# Altium schematic sheet backplane.SchDoc
size A2
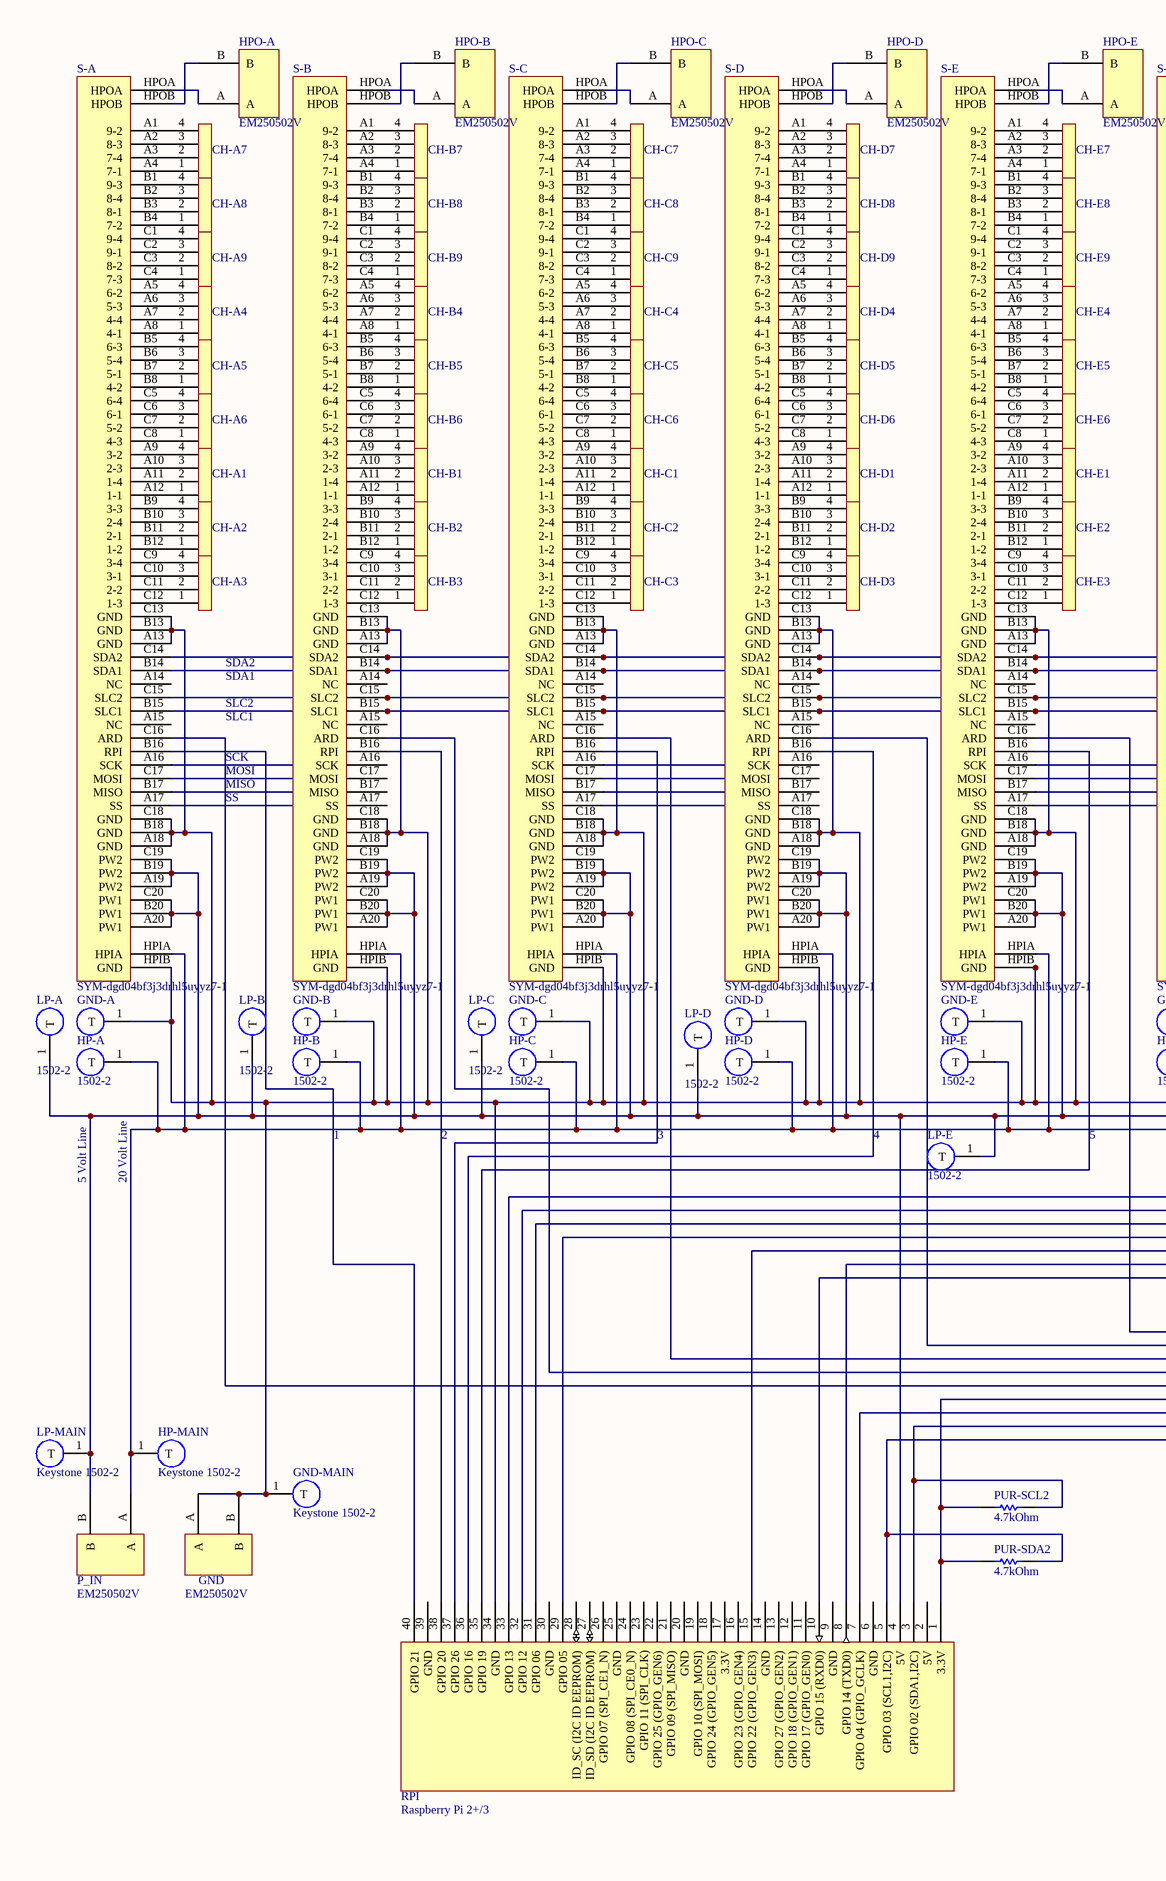
[diagram p0: backplane.SchDoc, left]
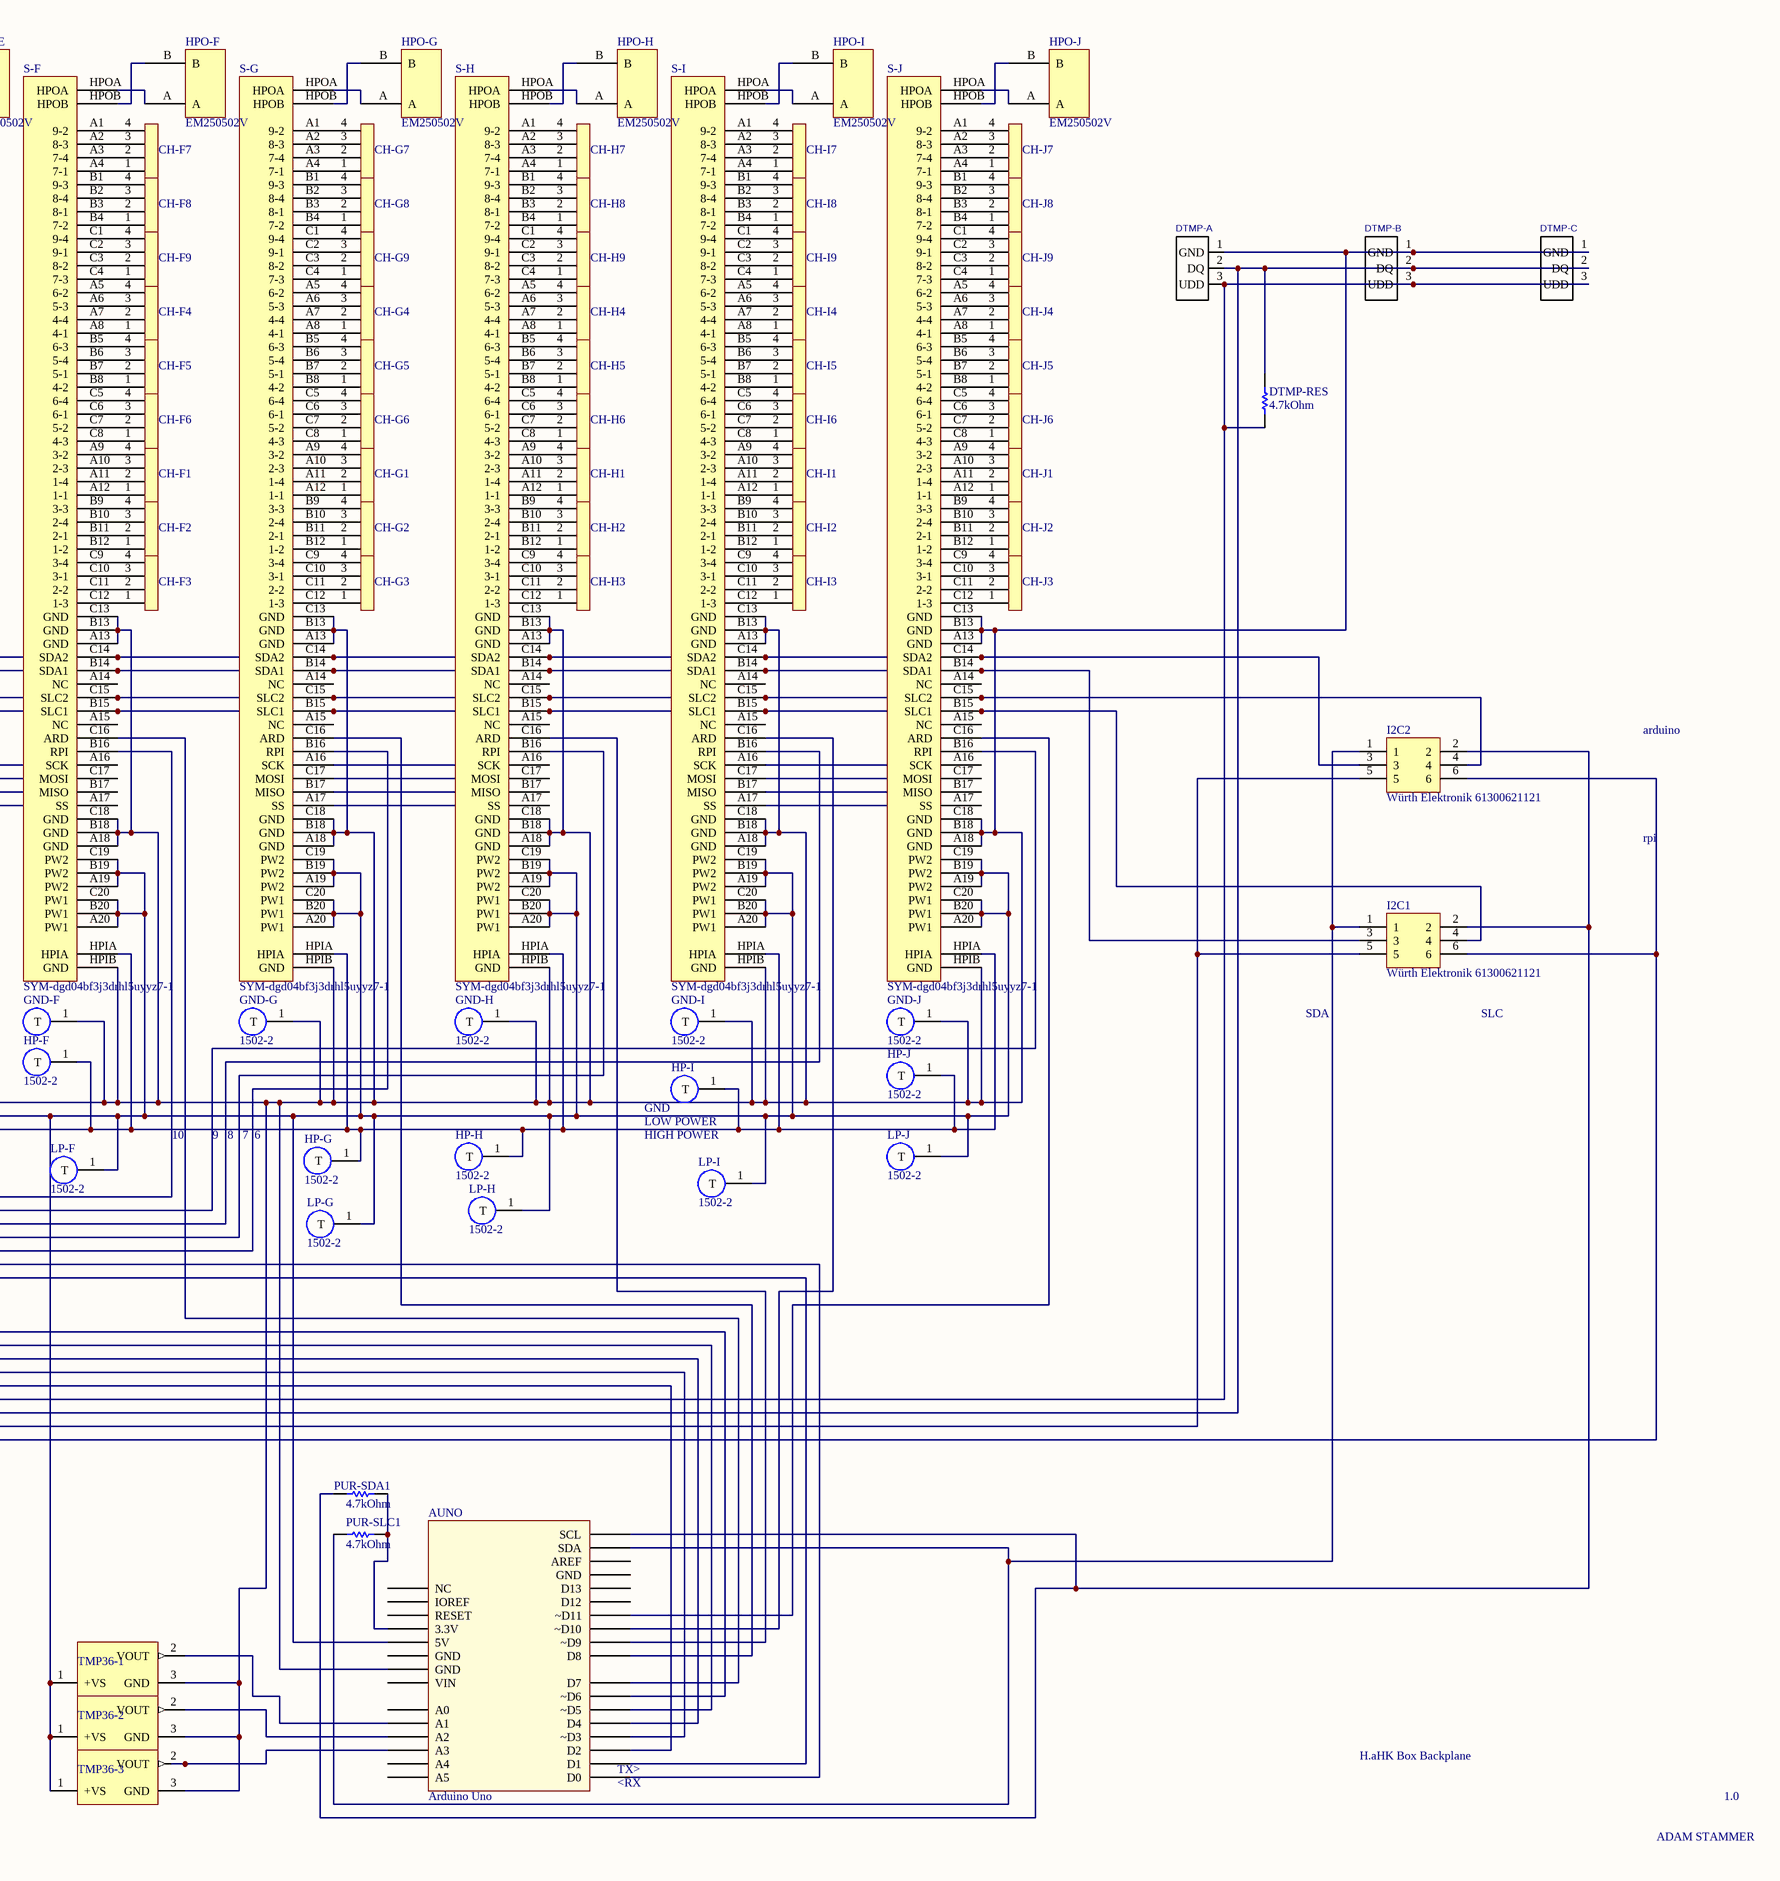
[diagram p1: backplane.SchDoc, right]

## Parts
AUNO  Arduino Uno  [PCB-5e3n8s0ey5jqr2f9nncc-1]
CH-A1  Molex 22-28-4043  [HEADER_1x4]  (value not drawn)
CH-A2  Molex 22-28-4043  [HEADER_1x4]  (value not drawn)
CH-A3  Molex 22-28-4043  [HEADER_1x4]  (value not drawn)
CH-A4  Molex 22-28-4043  [HEADER_1x4]  (value not drawn)
CH-A5  Molex 22-28-4043  [HEADER_1x4]  (value not drawn)
CH-A6  Molex 22-28-4043  [HEADER_1x4]  (value not drawn)
CH-A7  Molex 22-28-4043  [HEADER_1x4]  (value not drawn)
CH-A8  Molex 22-28-4043  [HEADER_1x4]  (value not drawn)
CH-A9  Molex 22-28-4043  [HEADER_1x4]  (value not drawn)
CH-B1  Molex 22-28-4043  [HEADER_1x4]  (value not drawn)
CH-B2  Molex 22-28-4043  [HEADER_1x4]  (value not drawn)
CH-B3  Molex 22-28-4043  [HEADER_1x4]  (value not drawn)
CH-B4  Molex 22-28-4043  [HEADER_1x4]  (value not drawn)
CH-B5  Molex 22-28-4043  [HEADER_1x4]  (value not drawn)
CH-B6  Molex 22-28-4043  [HEADER_1x4]  (value not drawn)
CH-B7  Molex 22-28-4043  [HEADER_1x4]  (value not drawn)
CH-B8  Molex 22-28-4043  [HEADER_1x4]  (value not drawn)
CH-B9  Molex 22-28-4043  [HEADER_1x4]  (value not drawn)
CH-C1  Molex 22-28-4043  [HEADER_1x4]  (value not drawn)
CH-C2  Molex 22-28-4043  [HEADER_1x4]  (value not drawn)
CH-C3  Molex 22-28-4043  [HEADER_1x4]  (value not drawn)
CH-C4  Molex 22-28-4043  [HEADER_1x4]  (value not drawn)
CH-C5  Molex 22-28-4043  [HEADER_1x4]  (value not drawn)
CH-C6  Molex 22-28-4043  [HEADER_1x4]  (value not drawn)
CH-C7  Molex 22-28-4043  [HEADER_1x4]  (value not drawn)
CH-C8  Molex 22-28-4043  [HEADER_1x4]  (value not drawn)
CH-C9  Molex 22-28-4043  [HEADER_1x4]  (value not drawn)
CH-D1  Molex 22-28-4043  [HEADER_1x4]  (value not drawn)
CH-D2  Molex 22-28-4043  [HEADER_1x4]  (value not drawn)
CH-D3  Molex 22-28-4043  [HEADER_1x4]  (value not drawn)
CH-D4  Molex 22-28-4043  [HEADER_1x4]  (value not drawn)
CH-D5  Molex 22-28-4043  [HEADER_1x4]  (value not drawn)
CH-D6  Molex 22-28-4043  [HEADER_1x4]  (value not drawn)
CH-D7  Molex 22-28-4043  [HEADER_1x4]  (value not drawn)
CH-D8  Molex 22-28-4043  [HEADER_1x4]  (value not drawn)
CH-D9  Molex 22-28-4043  [HEADER_1x4]  (value not drawn)
CH-E1  Molex 22-28-4043  [HEADER_1x4]  (value not drawn)
CH-E2  Molex 22-28-4043  [HEADER_1x4]  (value not drawn)
CH-E3  Molex 22-28-4043  [HEADER_1x4]  (value not drawn)
CH-E4  Molex 22-28-4043  [HEADER_1x4]  (value not drawn)
CH-E5  Molex 22-28-4043  [HEADER_1x4]  (value not drawn)
CH-E6  Molex 22-28-4043  [HEADER_1x4]  (value not drawn)
CH-E7  Molex 22-28-4043  [HEADER_1x4]  (value not drawn)
CH-E8  Molex 22-28-4043  [HEADER_1x4]  (value not drawn)
CH-E9  Molex 22-28-4043  [HEADER_1x4]  (value not drawn)
CH-F1  Molex 22-28-4043  [HEADER_1x4]  (value not drawn)
CH-F2  Molex 22-28-4043  [HEADER_1x4]  (value not drawn)
CH-F3  Molex 22-28-4043  [HEADER_1x4]  (value not drawn)
CH-F4  Molex 22-28-4043  [HEADER_1x4]  (value not drawn)
CH-F5  Molex 22-28-4043  [HEADER_1x4]  (value not drawn)
CH-F6  Molex 22-28-4043  [HEADER_1x4]  (value not drawn)
CH-F7  Molex 22-28-4043  [HEADER_1x4]  (value not drawn)
CH-F8  Molex 22-28-4043  [HEADER_1x4]  (value not drawn)
CH-F9  Molex 22-28-4043  [HEADER_1x4]  (value not drawn)
CH-G1  Molex 22-28-4043  [HEADER_1x4]  (value not drawn)
CH-G2  Molex 22-28-4043  [HEADER_1x4]  (value not drawn)
CH-G3  Molex 22-28-4043  [HEADER_1x4]  (value not drawn)
CH-G4  Molex 22-28-4043  [HEADER_1x4]  (value not drawn)
CH-G5  Molex 22-28-4043  [HEADER_1x4]  (value not drawn)
CH-G6  Molex 22-28-4043  [HEADER_1x4]  (value not drawn)
CH-G7  Molex 22-28-4043  [HEADER_1x4]  (value not drawn)
CH-G8  Molex 22-28-4043  [HEADER_1x4]  (value not drawn)
CH-G9  Molex 22-28-4043  [HEADER_1x4]  (value not drawn)
CH-H1  Molex 22-28-4043  [HEADER_1x4]  (value not drawn)
CH-H2  Molex 22-28-4043  [HEADER_1x4]  (value not drawn)
CH-H3  Molex 22-28-4043  [HEADER_1x4]  (value not drawn)
CH-H4  Molex 22-28-4043  [HEADER_1x4]  (value not drawn)
CH-H5  Molex 22-28-4043  [HEADER_1x4]  (value not drawn)
CH-H6  Molex 22-28-4043  [HEADER_1x4]  (value not drawn)
CH-H7  Molex 22-28-4043  [HEADER_1x4]  (value not drawn)
CH-H8  Molex 22-28-4043  [HEADER_1x4]  (value not drawn)
CH-H9  Molex 22-28-4043  [HEADER_1x4]  (value not drawn)
CH-I1  Molex 22-28-4043  [HEADER_1x4]  (value not drawn)
CH-I2  Molex 22-28-4043  [HEADER_1x4]  (value not drawn)
CH-I3  Molex 22-28-4043  [HEADER_1x4]  (value not drawn)
CH-I4  Molex 22-28-4043  [HEADER_1x4]  (value not drawn)
CH-I5  Molex 22-28-4043  [HEADER_1x4]  (value not drawn)
CH-I6  Molex 22-28-4043  [HEADER_1x4]  (value not drawn)
CH-I7  Molex 22-28-4043  [HEADER_1x4]  (value not drawn)
CH-I8  Molex 22-28-4043  [HEADER_1x4]  (value not drawn)
CH-I9  Molex 22-28-4043  [HEADER_1x4]  (value not drawn)
CH-J1  Molex 22-28-4043  [HEADER_1x4]  (value not drawn)
CH-J2  Molex 22-28-4043  [HEADER_1x4]  (value not drawn)
CH-J3  Molex 22-28-4043  [HEADER_1x4]  (value not drawn)
CH-J4  Molex 22-28-4043  [HEADER_1x4]  (value not drawn)
CH-J5  Molex 22-28-4043  [HEADER_1x4]  (value not drawn)
CH-J6  Molex 22-28-4043  [HEADER_1x4]  (value not drawn)
CH-J7  Molex 22-28-4043  [HEADER_1x4]  (value not drawn)
CH-J8  Molex 22-28-4043  [HEADER_1x4]  (value not drawn)
CH-J9  Molex 22-28-4043  [HEADER_1x4]  (value not drawn)
DTMP-A  Maxim Integrated DS18B20+  [PCB-6xl7qimvuxkxf3clfff9-1]  (value not drawn)
DTMP-B  Maxim Integrated DS18B20+  [PCB-6xl7qimvuxkxf3clfff9-1]  (value not drawn)
DTMP-C  Maxim Integrated DS18B20+  [PCB-6xl7qimvuxkxf3clfff9-1]  (value not drawn)
DTMP-RES  4.7kOhm  [PCB-3trqkg5dul8e4bq69e8d-1]
GND  EM250502V  [PCB-u2v43o1ftwqs3duy389i-1]
GND-A  1502-2  [PCB-3pxxqie2fct8emy2m3uy-1]  (value not drawn)
GND-B  1502-2  [PCB-3pxxqie2fct8emy2m3uy-1]  (value not drawn)
GND-C  1502-2  [PCB-3pxxqie2fct8emy2m3uy-1]  (value not drawn)
GND-D  1502-2  [PCB-3pxxqie2fct8emy2m3uy-1]  (value not drawn)
GND-E  1502-2  [PCB-3pxxqie2fct8emy2m3uy-1]  (value not drawn)
GND-F  1502-2  [PCB-3pxxqie2fct8emy2m3uy-1]  (value not drawn)
GND-G  1502-2  [PCB-3pxxqie2fct8emy2m3uy-1]
GND-H  1502-2  [PCB-3pxxqie2fct8emy2m3uy-1]
GND-I  1502-2  [PCB-3pxxqie2fct8emy2m3uy-1]
GND-J  1502-2  [PCB-3pxxqie2fct8emy2m3uy-1]
GND-MAIN  Keystone 1502-2  [PCB-3pxxqie2fct8emy2m3uy-1]
HP-A  1502-2  [PCB-3pxxqie2fct8emy2m3uy-1]
HP-B  1502-2  [PCB-3pxxqie2fct8emy2m3uy-1]
HP-C  1502-2  [PCB-3pxxqie2fct8emy2m3uy-1]
HP-D  1502-2  [PCB-3pxxqie2fct8emy2m3uy-1]
HP-E  1502-2  [PCB-3pxxqie2fct8emy2m3uy-1]
HP-F  1502-2  [PCB-3pxxqie2fct8emy2m3uy-1]
HP-G  1502-2  [PCB-3pxxqie2fct8emy2m3uy-1]
HP-H  1502-2  [PCB-3pxxqie2fct8emy2m3uy-1]
HP-I  1502-2  [PCB-3pxxqie2fct8emy2m3uy-1]  (value not drawn)
HP-J  1502-2  [PCB-3pxxqie2fct8emy2m3uy-1]
HP-MAIN  Keystone 1502-2  [PCB-3pxxqie2fct8emy2m3uy-1]
HPO-A  EM250502V  [PCB-u2v43o1ftwqs3duy389i-1]
HPO-B  EM250502V  [PCB-u2v43o1ftwqs3duy389i-1]
HPO-C  EM250502V  [PCB-u2v43o1ftwqs3duy389i-1]
HPO-D  EM250502V  [PCB-u2v43o1ftwqs3duy389i-1]
HPO-E  EM250502V  [PCB-u2v43o1ftwqs3duy389i-1]
HPO-F  EM250502V  [PCB-u2v43o1ftwqs3duy389i-1]
HPO-G  EM250502V  [PCB-u2v43o1ftwqs3duy389i-1]
HPO-H  EM250502V  [PCB-u2v43o1ftwqs3duy389i-1]
HPO-I  EM250502V  [PCB-u2v43o1ftwqs3duy389i-1]
HPO-J  EM250502V  [PCB-u2v43o1ftwqs3duy389i-1]
I2C1  Würth Elektronik 61300621121  [PCB-zvoyfznuc9b5lzhitk0z-1]
I2C2  Würth Elektronik 61300621121  [PCB-zvoyfznuc9b5lzhitk0z-1]
LP-A  1502-2  [PCB-3pxxqie2fct8emy2m3uy-1]
LP-B  1502-2  [PCB-3pxxqie2fct8emy2m3uy-1]
LP-C  1502-2  [PCB-3pxxqie2fct8emy2m3uy-1]
LP-D  1502-2  [PCB-3pxxqie2fct8emy2m3uy-1]
LP-E  1502-2  [PCB-3pxxqie2fct8emy2m3uy-1]
LP-F  1502-2  [PCB-3pxxqie2fct8emy2m3uy-1]
LP-G  1502-2  [PCB-3pxxqie2fct8emy2m3uy-1]
LP-H  1502-2  [PCB-3pxxqie2fct8emy2m3uy-1]
LP-I  1502-2  [PCB-3pxxqie2fct8emy2m3uy-1]
LP-J  1502-2  [PCB-3pxxqie2fct8emy2m3uy-1]
LP-MAIN  Keystone 1502-2  [PCB-3pxxqie2fct8emy2m3uy-1]
P_IN  EM250502V  [PCB-u2v43o1ftwqs3duy389i-1]
PUR-SCL2  4.7kOhm  [PCB-3trqkg5dul8e4bq69e8d-1]
PUR-SDA1  4.7kOhm  [PCB-3trqkg5dul8e4bq69e8d-1]
PUR-SDA2  4.7kOhm  [PCB-3trqkg5dul8e4bq69e8d-1]
PUR-SLC1  4.7kOhm  [PCB-3trqkg5dul8e4bq69e8d-1]
RPI  Raspberry Pi 2+/3  [Header Only]
S-A  SYM-dgd04bf3j3drhl5uyyz7-1  [PCBComponent_1 - duplicate]
S-B  SYM-dgd04bf3j3drhl5uyyz7-1  [PCBComponent_1 - duplicate]
S-C  SYM-dgd04bf3j3drhl5uyyz7-1  [PCBComponent_1 - duplicate]
S-D  SYM-dgd04bf3j3drhl5uyyz7-1  [PCBComponent_1 - duplicate]
S-E  SYM-dgd04bf3j3drhl5uyyz7-1  [PCBComponent_1 - duplicate]
S-F  SYM-dgd04bf3j3drhl5uyyz7-1  [PCBComponent_1 - duplicate]
S-G  SYM-dgd04bf3j3drhl5uyyz7-1  [PCBComponent_1 - duplicate]
S-H  SYM-dgd04bf3j3drhl5uyyz7-1  [PCBComponent_1 - duplicate]
S-I  SYM-dgd04bf3j3drhl5uyyz7-1  [PCBComponent_1 - duplicate]
S-J  SYM-dgd04bf3j3drhl5uyyz7-1  [PCBComponent_1 - duplicate]
TMP36-1  TMP36GT9  [ADI-T-3]  (value not drawn)
TMP36-2  TMP36GT9  [ADI-T-3]  (value not drawn)
TMP36-3  TMP36GT9  [ADI-T-3]  (value not drawn)

## Nets
NetAUNO_3.3V: AUNO.3.3V PUR-SDA1.2 PUR-SLC1.2
NetAUNO_5V: AUNO.5V LP-A.1(T) LP-B.1(T) LP-C.1(T) LP-D.1(T) LP-E.1(T) LP-F.1(T) LP-G.1(T) LP-H.1(T) LP-I.1(T) LP-J.1(T) LP-MAIN.1(T) P_IN.B RPI.4(5V) S-A.A19(PW2) S-A.A20(PW1) S-A.B19(PW2) S-A.B20(PW1) S-A.C19(PW2) S-A.C20(PW1) S-B.A19(PW2) S-B.A20(PW1) S-B.B19(PW2) S-B.B20(PW1) S-B.C19(PW2) S-B.C20(PW1) S-C.A19(PW2) S-C.A20(PW1) S-C.B19(PW2) S-C.B20(PW1) S-C.C19(PW2) S-C.C20(PW1) S-D.A19(PW2) S-D.A20(PW1) S-D.B19(PW2) S-D.B20(PW1) S-D.C19(PW2) S-D.C20(PW1) S-E.A19(PW2) S-E.A20(PW1) S-E.B19(PW2) S-E.B20(PW1) S-E.C19(PW2) S-E.C20(PW1) S-F.A19(PW2) S-F.A20(PW1) S-F.B19(PW2) S-F.B20(PW1) S-F.C19(PW2) S-F.C20(PW1) S-G.A19(PW2) S-G.A20(PW1) S-G.B19(PW2) S-G.B20(PW1) S-G.C19(PW2) S-G.C20(PW1) S-H.A19(PW2) S-H.A20(PW1) S-H.B19(PW2) S-H.B20(PW1) S-H.C19(PW2) S-H.C20(PW1) S-I.A19(PW2) S-I.A20(PW1) S-I.B19(PW2) S-I.B20(PW1) S-I.C19(PW2) S-I.C20(PW1) S-J.A19(PW2) S-J.A20(PW1) S-J.B19(PW2) S-J.B20(PW1) S-J.C19(PW2) S-J.C20(PW1) TMP36-1.1(+VS) TMP36-2.1(+VS) TMP36-3.1(+VS)
NetAUNO_A1: AUNO.A1 TMP36-1.2(VOUT)
NetAUNO_A2: AUNO.A2 TMP36-2.2(VOUT)
NetAUNO_A3: AUNO.A3 TMP36-3.2(VOUT)
NetAUNO_D0: AUNO.D0 RPI.8(GPIO_14_(TXD0))
NetAUNO_D1: AUNO.D1 RPI.10(GPIO_15_(RXD0))
NetAUNO_D2: AUNO.D2 S-A.C16(ARD)
NetAUNO_D3: AUNO.D3(~D3) S-B.C16(ARD)
NetAUNO_D4: AUNO.D4 S-C.C16(ARD)
NetAUNO_D5: AUNO.D5(~D5) S-D.C16(ARD)
NetAUNO_D6: AUNO.D6(~D6) S-E.C16(ARD)
NetAUNO_D7: AUNO.D7 S-F.C16(ARD)
NetAUNO_D8: AUNO.D8 S-G.C16(ARD)
NetAUNO_D9: AUNO.D9(~D9) S-H.C16(ARD)
NetAUNO_D10: AUNO.D10(~D10) S-I.C16(ARD)
NetAUNO_D11: AUNO.D11(~D11) S-J.C16(ARD)
NetAUNO_GND2: AUNO.GND2(GND) DTMP-A.1(GND) DTMP-B.1(GND) DTMP-C.1(GND) GND.A GND.B GND-A.1(T) GND-B.1(T) GND-C.1(T) GND-D.1(T) GND-E.1(T) GND-F.1(T) GND-G.1(T) GND-H.1(T) GND-I.1(T) GND-J.1(T) GND-MAIN.1(T) RPI.34(GND) S-A.A13(GND) S-A.A18(GND) S-A.B13(GND) S-A.B18(GND) S-A.C13(GND) S-A.C18(GND) S-A.HPIB(GND) S-B.A13(GND) S-B.A18(GND) S-B.B13(GND) S-B.B18(GND) S-B.C13(GND) S-B.C18(GND) S-B.HPIB(GND) S-C.A13(GND) S-C.A18(GND) S-C.B13(GND) S-C.B18(GND) S-C.C13(GND) S-C.C18(GND) S-C.HPIB(GND) S-D.A13(GND) S-D.A18(GND) S-D.B13(GND) S-D.B18(GND) S-D.C13(GND) S-D.C18(GND) S-D.HPIB(GND) S-E.A13(GND) S-E.A18(GND) S-E.B13(GND) S-E.B18(GND) S-E.C13(GND) S-E.C18(GND) S-E.HPIB(GND) S-F.A13(GND) S-F.A18(GND) S-F.B13(GND) S-F.B18(GND) S-F.C13(GND) S-F.C18(GND) S-F.HPIB(GND) S-G.A13(GND) S-G.A18(GND) S-G.B13(GND) S-G.B18(GND) S-G.C13(GND) S-G.C18(GND) S-G.HPIB(GND) S-H.A13(GND) S-H.A18(GND) S-H.B13(GND) S-H.B18(GND) S-H.C13(GND) S-H.C18(GND) S-H.HPIB(GND) S-I.A13(GND) S-I.A18(GND) S-I.B13(GND) S-I.B18(GND) S-I.C13(GND) S-I.C18(GND) S-I.HPIB(GND) S-J.A13(GND) S-J.A18(GND) S-J.B13(GND) S-J.B18(GND) S-J.C13(GND) S-J.C18(GND) S-J.HPIB(GND) TMP36-1.3(GND) TMP36-2.3(GND) TMP36-3.3(GND)
NetAUNO_SCL: AUNO.SCL I2C1.2 I2C2.2 PUR-SDA1.1
NetAUNO_SDA: AUNO.SDA I2C1.1 I2C2.1 PUR-SLC1.1
NetCH-A1_1: CH-A1.1 S-A.A12(1-1)
NetCH-A1_2: CH-A1.2 S-A.A11(1-4)
NetCH-A1_3: CH-A1.3 S-A.A10(2-3)
NetCH-A1_4: CH-A1.4 S-A.A9(3-2)
NetCH-A2_1: CH-A2.1 S-A.B12(1-2)
NetCH-A2_2: CH-A2.2 S-A.B11(2-1)
NetCH-A2_3: CH-A2.3 S-A.B10(2-4)
NetCH-A2_4: CH-A2.4 S-A.B9(3-3)
NetCH-A3_1: CH-A3.1 S-A.C12(1-3)
NetCH-A3_2: CH-A3.2 S-A.C11(2-2)
NetCH-A3_3: CH-A3.3 S-A.C10(3-1)
NetCH-A3_4: CH-A3.4 S-A.C9(3-4)
NetCH-A4_1: CH-A4.1 S-A.A8(4-1)
NetCH-A4_2: CH-A4.2 S-A.A7(4-4)
NetCH-A4_3: CH-A4.3 S-A.A6(5-3)
NetCH-A4_4: CH-A4.4 S-A.A5(6-2)
NetCH-A5_1: CH-A5.1 S-A.B8(4-2)
NetCH-A5_2: CH-A5.2 S-A.B7(5-1)
NetCH-A5_3: CH-A5.3 S-A.B6(5-4)
NetCH-A5_4: CH-A5.4 S-A.B5(6-3)
NetCH-A6_1: CH-A6.1 S-A.C8(4-3)
NetCH-A6_2: CH-A6.2 S-A.C7(5-2)
NetCH-A6_3: CH-A6.3 S-A.C6(6-1)
NetCH-A6_4: CH-A6.4 S-A.C5(6-4)
NetCH-A7_1: CH-A7.1 S-A.A4(7-1)
NetCH-A7_2: CH-A7.2 S-A.A3(7-4)
NetCH-A7_3: CH-A7.3 S-A.A2(8-3)
NetCH-A7_4: CH-A7.4 S-A.A1(9-2)
NetCH-A8_1: CH-A8.1 S-A.B4(7-2)
NetCH-A8_2: CH-A8.2 S-A.B3(8-1)
NetCH-A8_3: CH-A8.3 S-A.B2(8-4)
NetCH-A8_4: CH-A8.4 S-A.B1(9-3)
NetCH-A9_1: CH-A9.1 S-A.C4(7-3)
NetCH-A9_2: CH-A9.2 S-A.C3(8-2)
NetCH-A9_3: CH-A9.3 S-A.C2(9-1)
NetCH-A9_4: CH-A9.4 S-A.C1(9-4)
NetCH-B1_1: CH-B1.1 S-B.A12(1-1)
NetCH-B1_2: CH-B1.2 S-B.A11(1-4)
NetCH-B1_3: CH-B1.3 S-B.A10(2-3)
NetCH-B1_4: CH-B1.4 S-B.A9(3-2)
NetCH-B2_1: CH-B2.1 S-B.B12(1-2)
NetCH-B2_2: CH-B2.2 S-B.B11(2-1)
NetCH-B2_3: CH-B2.3 S-B.B10(2-4)
NetCH-B2_4: CH-B2.4 S-B.B9(3-3)
NetCH-B3_1: CH-B3.1 S-B.C12(1-3)
NetCH-B3_2: CH-B3.2 S-B.C11(2-2)
NetCH-B3_3: CH-B3.3 S-B.C10(3-1)
NetCH-B3_4: CH-B3.4 S-B.C9(3-4)
NetCH-B4_1: CH-B4.1 S-B.A8(4-1)
NetCH-B4_2: CH-B4.2 S-B.A7(4-4)
NetCH-B4_3: CH-B4.3 S-B.A6(5-3)
NetCH-B4_4: CH-B4.4 S-B.A5(6-2)
NetCH-B5_1: CH-B5.1 S-B.B8(4-2)
NetCH-B5_2: CH-B5.2 S-B.B7(5-1)
NetCH-B5_3: CH-B5.3 S-B.B6(5-4)
NetCH-B5_4: CH-B5.4 S-B.B5(6-3)
NetCH-B6_1: CH-B6.1 S-B.C8(4-3)
NetCH-B6_2: CH-B6.2 S-B.C7(5-2)
NetCH-B6_3: CH-B6.3 S-B.C6(6-1)
NetCH-B6_4: CH-B6.4 S-B.C5(6-4)
NetCH-B7_1: CH-B7.1 S-B.A4(7-1)
NetCH-B7_2: CH-B7.2 S-B.A3(7-4)
NetCH-B7_3: CH-B7.3 S-B.A2(8-3)
NetCH-B7_4: CH-B7.4 S-B.A1(9-2)
NetCH-B8_1: CH-B8.1 S-B.B4(7-2)
NetCH-B8_2: CH-B8.2 S-B.B3(8-1)
NetCH-B8_3: CH-B8.3 S-B.B2(8-4)
NetCH-B8_4: CH-B8.4 S-B.B1(9-3)
NetCH-B9_1: CH-B9.1 S-B.C4(7-3)
NetCH-B9_2: CH-B9.2 S-B.C3(8-2)
NetCH-B9_3: CH-B9.3 S-B.C2(9-1)
NetCH-B9_4: CH-B9.4 S-B.C1(9-4)
NetCH-C1_1: CH-C1.1 S-C.A12(1-1)
NetCH-C1_2: CH-C1.2 S-C.A11(1-4)
NetCH-C1_3: CH-C1.3 S-C.A10(2-3)
NetCH-C1_4: CH-C1.4 S-C.A9(3-2)
NetCH-C2_1: CH-C2.1 S-C.B12(1-2)
NetCH-C2_2: CH-C2.2 S-C.B11(2-1)
NetCH-C2_3: CH-C2.3 S-C.B10(2-4)
NetCH-C2_4: CH-C2.4 S-C.B9(3-3)
NetCH-C3_1: CH-C3.1 S-C.C12(1-3)
NetCH-C3_2: CH-C3.2 S-C.C11(2-2)
NetCH-C3_3: CH-C3.3 S-C.C10(3-1)
NetCH-C3_4: CH-C3.4 S-C.C9(3-4)
NetCH-C4_1: CH-C4.1 S-C.A8(4-1)
NetCH-C4_2: CH-C4.2 S-C.A7(4-4)
NetCH-C4_3: CH-C4.3 S-C.A6(5-3)
NetCH-C4_4: CH-C4.4 S-C.A5(6-2)
NetCH-C5_1: CH-C5.1 S-C.B8(4-2)
NetCH-C5_2: CH-C5.2 S-C.B7(5-1)
NetCH-C5_3: CH-C5.3 S-C.B6(5-4)
NetCH-C5_4: CH-C5.4 S-C.B5(6-3)
NetCH-C6_1: CH-C6.1 S-C.C8(4-3)
NetCH-C6_2: CH-C6.2 S-C.C7(5-2)
NetCH-C6_3: CH-C6.3 S-C.C6(6-1)
NetCH-C6_4: CH-C6.4 S-C.C5(6-4)
NetCH-C7_1: CH-C7.1 S-C.A4(7-1)
NetCH-C7_2: CH-C7.2 S-C.A3(7-4)
NetCH-C7_3: CH-C7.3 S-C.A2(8-3)
NetCH-C7_4: CH-C7.4 S-C.A1(9-2)
NetCH-C8_1: CH-C8.1 S-C.B4(7-2)
NetCH-C8_2: CH-C8.2 S-C.B3(8-1)
NetCH-C8_3: CH-C8.3 S-C.B2(8-4)
NetCH-C8_4: CH-C8.4 S-C.B1(9-3)
NetCH-C9_1: CH-C9.1 S-C.C4(7-3)
NetCH-C9_2: CH-C9.2 S-C.C3(8-2)
NetCH-C9_3: CH-C9.3 S-C.C2(9-1)
NetCH-C9_4: CH-C9.4 S-C.C1(9-4)
NetCH-D1_1: CH-D1.1 S-D.A12(1-1)
NetCH-D1_2: CH-D1.2 S-D.A11(1-4)
NetCH-D1_3: CH-D1.3 S-D.A10(2-3)
NetCH-D1_4: CH-D1.4 S-D.A9(3-2)
NetCH-D2_1: CH-D2.1 S-D.B12(1-2)
NetCH-D2_2: CH-D2.2 S-D.B11(2-1)
NetCH-D2_3: CH-D2.3 S-D.B10(2-4)
NetCH-D2_4: CH-D2.4 S-D.B9(3-3)
NetCH-D3_1: CH-D3.1 S-D.C12(1-3)
NetCH-D3_2: CH-D3.2 S-D.C11(2-2)
NetCH-D3_3: CH-D3.3 S-D.C10(3-1)
NetCH-D3_4: CH-D3.4 S-D.C9(3-4)
NetCH-D4_1: CH-D4.1 S-D.A8(4-1)
NetCH-D4_2: CH-D4.2 S-D.A7(4-4)
NetCH-D4_3: CH-D4.3 S-D.A6(5-3)
NetCH-D4_4: CH-D4.4 S-D.A5(6-2)
NetCH-D5_1: CH-D5.1 S-D.B8(4-2)
NetCH-D5_2: CH-D5.2 S-D.B7(5-1)
NetCH-D5_3: CH-D5.3 S-D.B6(5-4)
NetCH-D5_4: CH-D5.4 S-D.B5(6-3)
NetCH-D6_1: CH-D6.1 S-D.C8(4-3)
NetCH-D6_2: CH-D6.2 S-D.C7(5-2)
NetCH-D6_3: CH-D6.3 S-D.C6(6-1)
NetCH-D6_4: CH-D6.4 S-D.C5(6-4)
NetCH-D7_1: CH-D7.1 S-D.A4(7-1)
NetCH-D7_2: CH-D7.2 S-D.A3(7-4)
NetCH-D7_3: CH-D7.3 S-D.A2(8-3)
NetCH-D7_4: CH-D7.4 S-D.A1(9-2)
NetCH-D8_1: CH-D8.1 S-D.B4(7-2)
NetCH-D8_2: CH-D8.2 S-D.B3(8-1)
NetCH-D8_3: CH-D8.3 S-D.B2(8-4)
NetCH-D8_4: CH-D8.4 S-D.B1(9-3)
NetCH-D9_1: CH-D9.1 S-D.C4(7-3)
NetCH-D9_2: CH-D9.2 S-D.C3(8-2)
NetCH-D9_3: CH-D9.3 S-D.C2(9-1)
NetCH-D9_4: CH-D9.4 S-D.C1(9-4)
NetCH-E1_1: CH-E1.1 S-E.A12(1-1)
NetCH-E1_2: CH-E1.2 S-E.A11(1-4)
NetCH-E1_3: CH-E1.3 S-E.A10(2-3)
NetCH-E1_4: CH-E1.4 S-E.A9(3-2)
NetCH-E2_1: CH-E2.1 S-E.B12(1-2)
NetCH-E2_2: CH-E2.2 S-E.B11(2-1)
NetCH-E2_3: CH-E2.3 S-E.B10(2-4)
NetCH-E2_4: CH-E2.4 S-E.B9(3-3)
NetCH-E3_1: CH-E3.1 S-E.C12(1-3)
NetCH-E3_2: CH-E3.2 S-E.C11(2-2)
NetCH-E3_3: CH-E3.3 S-E.C10(3-1)
NetCH-E3_4: CH-E3.4 S-E.C9(3-4)
NetCH-E4_1: CH-E4.1 S-E.A8(4-1)
NetCH-E4_2: CH-E4.2 S-E.A7(4-4)
NetCH-E4_3: CH-E4.3 S-E.A6(5-3)
NetCH-E4_4: CH-E4.4 S-E.A5(6-2)
NetCH-E5_1: CH-E5.1 S-E.B8(4-2)
NetCH-E5_2: CH-E5.2 S-E.B7(5-1)
NetCH-E5_3: CH-E5.3 S-E.B6(5-4)
NetCH-E5_4: CH-E5.4 S-E.B5(6-3)
NetCH-E6_1: CH-E6.1 S-E.C8(4-3)
NetCH-E6_2: CH-E6.2 S-E.C7(5-2)
NetCH-E6_3: CH-E6.3 S-E.C6(6-1)
NetCH-E6_4: CH-E6.4 S-E.C5(6-4)
NetCH-E7_1: CH-E7.1 S-E.A4(7-1)
NetCH-E7_2: CH-E7.2 S-E.A3(7-4)
NetCH-E7_3: CH-E7.3 S-E.A2(8-3)
NetCH-E7_4: CH-E7.4 S-E.A1(9-2)
NetCH-E8_1: CH-E8.1 S-E.B4(7-2)
NetCH-E8_2: CH-E8.2 S-E.B3(8-1)
NetCH-E8_3: CH-E8.3 S-E.B2(8-4)
NetCH-E8_4: CH-E8.4 S-E.B1(9-3)
NetCH-E9_1: CH-E9.1 S-E.C4(7-3)
NetCH-E9_2: CH-E9.2 S-E.C3(8-2)
NetCH-E9_3: CH-E9.3 S-E.C2(9-1)
NetCH-E9_4: CH-E9.4 S-E.C1(9-4)
NetCH-F1_1: CH-F1.1 S-F.A12(1-1)
NetCH-F1_2: CH-F1.2 S-F.A11(1-4)
NetCH-F1_3: CH-F1.3 S-F.A10(2-3)
NetCH-F1_4: CH-F1.4 S-F.A9(3-2)
NetCH-F2_1: CH-F2.1 S-F.B12(1-2)
NetCH-F2_2: CH-F2.2 S-F.B11(2-1)
NetCH-F2_3: CH-F2.3 S-F.B10(2-4)
NetCH-F2_4: CH-F2.4 S-F.B9(3-3)
NetCH-F3_1: CH-F3.1 S-F.C12(1-3)
NetCH-F3_2: CH-F3.2 S-F.C11(2-2)
NetCH-F3_3: CH-F3.3 S-F.C10(3-1)
NetCH-F3_4: CH-F3.4 S-F.C9(3-4)
NetCH-F4_1: CH-F4.1 S-F.A8(4-1)
NetCH-F4_2: CH-F4.2 S-F.A7(4-4)
NetCH-F4_3: CH-F4.3 S-F.A6(5-3)
NetCH-F4_4: CH-F4.4 S-F.A5(6-2)
NetCH-F5_1: CH-F5.1 S-F.B8(4-2)
NetCH-F5_2: CH-F5.2 S-F.B7(5-1)
NetCH-F5_3: CH-F5.3 S-F.B6(5-4)
NetCH-F5_4: CH-F5.4 S-F.B5(6-3)
NetCH-F6_1: CH-F6.1 S-F.C8(4-3)
NetCH-F6_2: CH-F6.2 S-F.C7(5-2)
NetCH-F6_3: CH-F6.3 S-F.C6(6-1)
NetCH-F6_4: CH-F6.4 S-F.C5(6-4)
NetCH-F7_1: CH-F7.1 S-F.A4(7-1)
NetCH-F7_2: CH-F7.2 S-F.A3(7-4)
NetCH-F7_3: CH-F7.3 S-F.A2(8-3)
NetCH-F7_4: CH-F7.4 S-F.A1(9-2)
NetCH-F8_1: CH-F8.1 S-F.B4(7-2)
NetCH-F8_2: CH-F8.2 S-F.B3(8-1)
NetCH-F8_3: CH-F8.3 S-F.B2(8-4)
NetCH-F8_4: CH-F8.4 S-F.B1(9-3)
NetCH-F9_1: CH-F9.1 S-F.C4(7-3)
NetCH-F9_2: CH-F9.2 S-F.C3(8-2)
NetCH-F9_3: CH-F9.3 S-F.C2(9-1)
NetCH-F9_4: CH-F9.4 S-F.C1(9-4)
NetCH-G1_1: CH-G1.1 S-G.A12(1-1)
NetCH-G1_2: CH-G1.2 S-G.A11(1-4)
NetCH-G1_3: CH-G1.3 S-G.A10(2-3)
NetCH-G1_4: CH-G1.4 S-G.A9(3-2)
NetCH-G2_1: CH-G2.1 S-G.B12(1-2)
NetCH-G2_2: CH-G2.2 S-G.B11(2-1)
NetCH-G2_3: CH-G2.3 S-G.B10(2-4)
NetCH-G2_4: CH-G2.4 S-G.B9(3-3)
NetCH-G3_1: CH-G3.1 S-G.C12(1-3)
NetCH-G3_2: CH-G3.2 S-G.C11(2-2)
NetCH-G3_3: CH-G3.3 S-G.C10(3-1)
NetCH-G3_4: CH-G3.4 S-G.C9(3-4)
NetCH-G4_1: CH-G4.1 S-G.A8(4-1)
NetCH-G4_2: CH-G4.2 S-G.A7(4-4)
NetCH-G4_3: CH-G4.3 S-G.A6(5-3)
NetCH-G4_4: CH-G4.4 S-G.A5(6-2)
NetCH-G5_1: CH-G5.1 S-G.B8(4-2)
NetCH-G5_2: CH-G5.2 S-G.B7(5-1)
NetCH-G5_3: CH-G5.3 S-G.B6(5-4)
NetCH-G5_4: CH-G5.4 S-G.B5(6-3)
NetCH-G6_1: CH-G6.1 S-G.C8(4-3)
NetCH-G6_2: CH-G6.2 S-G.C7(5-2)
NetCH-G6_3: CH-G6.3 S-G.C6(6-1)
NetCH-G6_4: CH-G6.4 S-G.C5(6-4)
NetCH-G7_1: CH-G7.1 S-G.A4(7-1)
NetCH-G7_2: CH-G7.2 S-G.A3(7-4)
NetCH-G7_3: CH-G7.3 S-G.A2(8-3)
NetCH-G7_4: CH-G7.4 S-G.A1(9-2)
NetCH-G8_1: CH-G8.1 S-G.B4(7-2)
NetCH-G8_2: CH-G8.2 S-G.B3(8-1)
NetCH-G8_3: CH-G8.3 S-G.B2(8-4)
NetCH-G8_4: CH-G8.4 S-G.B1(9-3)
NetCH-G9_1: CH-G9.1 S-G.C4(7-3)
NetCH-G9_2: CH-G9.2 S-G.C3(8-2)
NetCH-G9_3: CH-G9.3 S-G.C2(9-1)
NetCH-G9_4: CH-G9.4 S-G.C1(9-4)
NetCH-H1_1: CH-H1.1 S-H.A12(1-1)
NetCH-H1_2: CH-H1.2 S-H.A11(1-4)
NetCH-H1_3: CH-H1.3 S-H.A10(2-3)
NetCH-H1_4: CH-H1.4 S-H.A9(3-2)
NetCH-H2_1: CH-H2.1 S-H.B12(1-2)
NetCH-H2_2: CH-H2.2 S-H.B11(2-1)
NetCH-H2_3: CH-H2.3 S-H.B10(2-4)
NetCH-H2_4: CH-H2.4 S-H.B9(3-3)
NetCH-H3_1: CH-H3.1 S-H.C12(1-3)
NetCH-H3_2: CH-H3.2 S-H.C11(2-2)
NetCH-H3_3: CH-H3.3 S-H.C10(3-1)
NetCH-H3_4: CH-H3.4 S-H.C9(3-4)
NetCH-H4_1: CH-H4.1 S-H.A8(4-1)
NetCH-H4_2: CH-H4.2 S-H.A7(4-4)
NetCH-H4_3: CH-H4.3 S-H.A6(5-3)
NetCH-H4_4: CH-H4.4 S-H.A5(6-2)
NetCH-H5_1: CH-H5.1 S-H.B8(4-2)
NetCH-H5_2: CH-H5.2 S-H.B7(5-1)
NetCH-H5_3: CH-H5.3 S-H.B6(5-4)
NetCH-H5_4: CH-H5.4 S-H.B5(6-3)
NetCH-H6_1: CH-H6.1 S-H.C8(4-3)
NetCH-H6_2: CH-H6.2 S-H.C7(5-2)
NetCH-H6_3: CH-H6.3 S-H.C6(6-1)
NetCH-H6_4: CH-H6.4 S-H.C5(6-4)
NetCH-H7_1: CH-H7.1 S-H.A4(7-1)
NetCH-H7_2: CH-H7.2 S-H.A3(7-4)
NetCH-H7_3: CH-H7.3 S-H.A2(8-3)
NetCH-H7_4: CH-H7.4 S-H.A1(9-2)
NetCH-H8_1: CH-H8.1 S-H.B4(7-2)
NetCH-H8_2: CH-H8.2 S-H.B3(8-1)
NetCH-H8_3: CH-H8.3 S-H.B2(8-4)
NetCH-H8_4: CH-H8.4 S-H.B1(9-3)
NetCH-H9_1: CH-H9.1 S-H.C4(7-3)
NetCH-H9_2: CH-H9.2 S-H.C3(8-2)
NetCH-H9_3: CH-H9.3 S-H.C2(9-1)
NetCH-H9_4: CH-H9.4 S-H.C1(9-4)
NetCH-I1_1: CH-I1.1 S-I.A12(1-1)
NetCH-I1_2: CH-I1.2 S-I.A11(1-4)
NetCH-I1_3: CH-I1.3 S-I.A10(2-3)
NetCH-I1_4: CH-I1.4 S-I.A9(3-2)
NetCH-I2_1: CH-I2.1 S-I.B12(1-2)
NetCH-I2_2: CH-I2.2 S-I.B11(2-1)
NetCH-I2_3: CH-I2.3 S-I.B10(2-4)
NetCH-I2_4: CH-I2.4 S-I.B9(3-3)
NetCH-I3_1: CH-I3.1 S-I.C12(1-3)
NetCH-I3_2: CH-I3.2 S-I.C11(2-2)
NetCH-I3_3: CH-I3.3 S-I.C10(3-1)
NetCH-I3_4: CH-I3.4 S-I.C9(3-4)
NetCH-I4_1: CH-I4.1 S-I.A8(4-1)
NetCH-I4_2: CH-I4.2 S-I.A7(4-4)
NetCH-I4_3: CH-I4.3 S-I.A6(5-3)
NetCH-I4_4: CH-I4.4 S-I.A5(6-2)
NetCH-I5_1: CH-I5.1 S-I.B8(4-2)
NetCH-I5_2: CH-I5.2 S-I.B7(5-1)
NetCH-I5_3: CH-I5.3 S-I.B6(5-4)
NetCH-I5_4: CH-I5.4 S-I.B5(6-3)
NetCH-I6_1: CH-I6.1 S-I.C8(4-3)
NetCH-I6_2: CH-I6.2 S-I.C7(5-2)
NetCH-I6_3: CH-I6.3 S-I.C6(6-1)
NetCH-I6_4: CH-I6.4 S-I.C5(6-4)
NetCH-I7_1: CH-I7.1 S-I.A4(7-1)
NetCH-I7_2: CH-I7.2 S-I.A3(7-4)
NetCH-I7_3: CH-I7.3 S-I.A2(8-3)
NetCH-I7_4: CH-I7.4 S-I.A1(9-2)
NetCH-I8_1: CH-I8.1 S-I.B4(7-2)
NetCH-I8_2: CH-I8.2 S-I.B3(8-1)
NetCH-I8_3: CH-I8.3 S-I.B2(8-4)
NetCH-I8_4: CH-I8.4 S-I.B1(9-3)
NetCH-I9_1: CH-I9.1 S-I.C4(7-3)
NetCH-I9_2: CH-I9.2 S-I.C3(8-2)
NetCH-I9_3: CH-I9.3 S-I.C2(9-1)
NetCH-I9_4: CH-I9.4 S-I.C1(9-4)
NetCH-J1_1: CH-J1.1 S-J.A12(1-1)
NetCH-J1_2: CH-J1.2 S-J.A11(1-4)
NetCH-J1_3: CH-J1.3 S-J.A10(2-3)
NetCH-J1_4: CH-J1.4 S-J.A9(3-2)
NetCH-J2_1: CH-J2.1 S-J.B12(1-2)
NetCH-J2_2: CH-J2.2 S-J.B11(2-1)
NetCH-J2_3: CH-J2.3 S-J.B10(2-4)
NetCH-J2_4: CH-J2.4 S-J.B9(3-3)
NetCH-J3_1: CH-J3.1 S-J.C12(1-3)
NetCH-J3_2: CH-J3.2 S-J.C11(2-2)
NetCH-J3_3: CH-J3.3 S-J.C10(3-1)
NetCH-J3_4: CH-J3.4 S-J.C9(3-4)
NetCH-J4_1: CH-J4.1 S-J.A8(4-1)
NetCH-J4_2: CH-J4.2 S-J.A7(4-4)
NetCH-J4_3: CH-J4.3 S-J.A6(5-3)
NetCH-J4_4: CH-J4.4 S-J.A5(6-2)
NetCH-J5_1: CH-J5.1 S-J.B8(4-2)
NetCH-J5_2: CH-J5.2 S-J.B7(5-1)
NetCH-J5_3: CH-J5.3 S-J.B6(5-4)
NetCH-J5_4: CH-J5.4 S-J.B5(6-3)
NetCH-J6_1: CH-J6.1 S-J.C8(4-3)
NetCH-J6_2: CH-J6.2 S-J.C7(5-2)
NetCH-J6_3: CH-J6.3 S-J.C6(6-1)
NetCH-J6_4: CH-J6.4 S-J.C5(6-4)
NetCH-J7_1: CH-J7.1 S-J.A4(7-1)
NetCH-J7_2: CH-J7.2 S-J.A3(7-4)
NetCH-J7_3: CH-J7.3 S-J.A2(8-3)
NetCH-J7_4: CH-J7.4 S-J.A1(9-2)
NetCH-J8_1: CH-J8.1 S-J.B4(7-2)
NetCH-J8_2: CH-J8.2 S-J.B3(8-1)
NetCH-J8_3: CH-J8.3 S-J.B2(8-4)
NetCH-J8_4: CH-J8.4 S-J.B1(9-3)
NetCH-J9_1: CH-J9.1 S-J.C4(7-3)
NetCH-J9_2: CH-J9.2 S-J.C3(8-2)
NetCH-J9_3: CH-J9.3 S-J.C2(9-1)
NetCH-J9_4: CH-J9.4 S-J.C1(9-4)
NetDTMP-A_2: DTMP-A.2(DQ) DTMP-B.2(DQ) DTMP-C.2(DQ) DTMP-RES.2 RPI.7(GPIO_04_(GPIO_GCLK))
NetDTMP-A_3: DTMP-A.3(UDD) DTMP-B.3(UDD) DTMP-C.3(UDD) DTMP-RES.1 PUR-SCL2.1 PUR-SDA2.1 RPI.1(3.3V)
NetHP-A_1: HP-A.1(T) HP-B.1(T) HP-C.1(T) HP-D.1(T) HP-E.1(T) HP-F.1(T) HP-G.1(T) HP-H.1(T) HP-I.1(T) HP-J.1(T) HP-MAIN.1(T) P_IN.A S-A.HPIA S-B.HPIA S-C.HPIA S-D.HPIA S-E.HPIA S-F.HPIA S-G.HPIA S-H.HPIA S-I.HPIA S-J.HPIA
NetHPO-A_A: HPO-A.A S-A.HPOA
NetHPO-A_B: HPO-A.B S-A.HPOB
NetHPO-B_A: HPO-B.A S-B.HPOA
NetHPO-B_B: HPO-B.B S-B.HPOB
NetHPO-C_A: HPO-C.A S-C.HPOA
NetHPO-C_B: HPO-C.B S-C.HPOB
NetHPO-D_A: HPO-D.A S-D.HPOA
NetHPO-D_B: HPO-D.B S-D.HPOB
NetHPO-E_A: HPO-E.A S-E.HPOA
NetHPO-E_B: HPO-E.B S-E.HPOB
NetHPO-F_A: HPO-F.A S-F.HPOA
NetHPO-F_B: HPO-F.B S-F.HPOB
NetHPO-G_A: HPO-G.A S-G.HPOA
NetHPO-G_B: HPO-G.B S-G.HPOB
NetHPO-H_A: HPO-H.A S-H.HPOA
NetHPO-H_B: HPO-H.B S-H.HPOB
NetHPO-I_A: HPO-I.A S-I.HPOA
NetHPO-I_B: HPO-I.B S-I.HPOB
NetHPO-J_A: HPO-J.A S-J.HPOA
NetHPO-J_B: HPO-J.B S-J.HPOB
NetI2C1_3: I2C1.3 S-A.B14(SDA1) S-B.B14(SDA1) S-C.B14(SDA1) S-D.B14(SDA1) S-E.B14(SDA1) S-F.B14(SDA1) S-G.B14(SDA1) S-H.B14(SDA1) S-I.B14(SDA1) S-J.B14(SDA1)
NetI2C1_4: I2C1.4 S-A.B15(SLC1) S-B.B15(SLC1) S-C.B15(SLC1) S-D.B15(SLC1) S-E.B15(SLC1) S-F.B15(SLC1) S-G.B15(SLC1) S-H.B15(SLC1) S-I.B15(SLC1) S-J.B15(SLC1)
NetI2C1_5: I2C1.5 I2C2.5 PUR-SCL2.2 RPI.3(GPIO_02_(SDA1,I2C))
NetI2C1_6: I2C1.6 I2C2.6 PUR-SDA2.2 RPI.5(GPIO_03_(SCL1,I2C))
NetI2C2_3: I2C2.3 S-A.C14(SDA2) S-B.C14(SDA2) S-C.C14(SDA2) S-D.C14(SDA2) S-E.C14(SDA2) S-F.C14(SDA2) S-G.C14(SDA2) S-H.C14(SDA2) S-I.C14(SDA2) S-J.C14(SDA2)
NetI2C2_4: I2C2.4 S-A.C15(SLC2) S-B.C15(SLC2) S-C.C15(SLC2) S-D.C15(SLC2) S-E.C15(SLC2) S-F.C15(SLC2) S-G.C15(SLC2) S-H.C15(SLC2) S-I.C15(SLC2) S-J.C15(SLC2)
NetRPI_15: RPI.15(GPIO_22_(GPIO_GEN3)) S-G.B16(RPI)
NetRPI_29: RPI.29(GPIO_05) S-H.B16(RPI)
NetRPI_31: RPI.31(GPIO_06) S-I.B16(RPI)
NetRPI_32: RPI.32(GPIO_12) S-J.B16(RPI)
NetRPI_33: RPI.33(GPIO_13) S-F.B16(RPI)
NetRPI_35: RPI.35(GPIO_19) S-E.B16(RPI)
NetRPI_36: RPI.36(GPIO_16) S-D.B16(RPI)
NetRPI_37: RPI.37(GPIO_26) S-C.B16(RPI)
NetRPI_38: RPI.38(GPIO_20) S-B.B16(RPI)
NetRPI_40: RPI.40(GPIO_21) S-A.B16(RPI)
NetS-A_A16: S-A.A16(SCK) S-B.A16(SCK)
NetS-A_A17: S-A.A17(SS) S-B.A17(SS)
NetS-A_B17: S-A.B17(MISO) S-B.B17(MISO)
NetS-A_C17: S-A.C17(MOSI) S-B.C17(MOSI)
NetS-C_A16: S-C.A16(SCK) S-D.A16(SCK)
NetS-C_A17: S-C.A17(SS) S-D.A17(SS)
NetS-C_B17: S-C.B17(MISO) S-D.B17(MISO)
NetS-C_C17: S-C.C17(MOSI) S-D.C17(MOSI)
NetS-E_A16: S-E.A16(SCK) S-F.A16(SCK)
NetS-E_A17: S-E.A17(SS) S-F.A17(SS)
NetS-E_B17: S-E.B17(MISO) S-F.B17(MISO)
NetS-E_C17: S-E.C17(MOSI) S-F.C17(MOSI)
NetS-G_A16: S-G.A16(SCK) S-H.A16(SCK)
NetS-G_A17: S-G.A17(SS) S-H.A17(SS)
NetS-G_B17: S-G.B17(MISO) S-H.B17(MISO)
NetS-G_C17: S-G.C17(MOSI) S-H.C17(MOSI)
NetS-I_A16: S-I.A16(SCK) S-J.A16(SCK)
NetS-I_A17: S-I.A17(SS) S-J.A17(SS)
NetS-I_B17: S-I.B17(MISO) S-J.B17(MISO)
NetS-I_C17: S-I.C17(MOSI) S-J.C17(MOSI)

Not connected (* = marked no-connect by the designer): AUNO A0 A4 A5 AREF D12 D13 GND1(GND) GND3(GND) IOREF NC RESET VIN; RPI 2(5V) 6(GND) 9(GND) 11(GPIO_17_(GPIO_GEN0)) 12(GPIO_18_(GPIO_GEN1)) 13(GPIO_27_(GPIO_GEN2)) 14(GND) 16(GPIO_23_(GPIO_GEN4)) 17(3.3V) 18(GPIO_24_(GPIO_GEN5)) 19(GPIO_10_(SPI_MOSI)) 20(GND) 21(GPIO_09_(SPI_MISO)) 22(GPIO_25_(GPIO_GEN6)) 23(GPIO_11_(SPI_CLK)) 24(GPIO_08_(SPI_CE0_N)) 25(GND) 26(GPIO_07_(SPI_CE1_N)) 27(ID_SD_(I2C_ID_EEPROM)) 28(ID_SC_(I2C_ID_EEPROM)) 30(GND) 39(GND); S-A A14(NC) A15(NC); S-B A14(NC) A15(NC); S-C A14(NC) A15(NC); S-D A14(NC) A15(NC); S-E A14(NC) A15(NC); S-F A14(NC) A15(NC); S-G A14(NC) A15(NC); S-H A14(NC) A15(NC); S-I A14(NC) A15(NC); S-J A14(NC) A15(NC)

## Notes on the sheet
- SDA1
- SDA2
- SLC1
- SCK
- SLC2
- arduino
- MOSI
- MISO
- SS
- rpi
- SDA
- SLC
- 1
- 2
- 3
- 4
- 5
- 10
- (near HP-G) 9   8   7  6
- (near HP-I) LOW POWER
- (near HP-I) GND
- HIGH POWER
- 5 Volt Line
- (near HP-A) 20 Volt Line
- (near AUNO) TX>
- H.aHK Box Backplane
- (near AUNO) <RX
- ADAM STAMMER
- 1.0

## Library data of the parts
AUNO = CMP-1073962-71: Microcontroller board, Uno [Arduino] A000066 Microcontroller board, Uno 7640152110092; Number of Bits: 8; Octopart URL: http://octopart.com/a000066-arduino-21222240
CH-A1-CH-A9 CH-B1-CH-B9 CH-C1-CH-C9 CH-D1-CH-D9 CH-E1-CH-E9 CH-F1-CH-F9 CH-G1-CH-G9 CH-H1-CH-H9 CH-I1-CH-I9 CH-J1-CH-J9 = CMP-44448d4a5f9d9b83-3: Conn; Rect./PCB; Breakaway Header; 4 Cir.; Vert.; KK 254 Ser.; Gold Plate; 6.09mm Pin L; Current Rating: 4.00 A; Voltage Rating (DC): 250 V; Gender: Male; Lead-Free Status: Lead Free; Number of Circuits: 4; Pin Pitch: 2.54 mm; Glow Wire Compliant: Non-Compliant; RoHS: Compliant; REACH SVHC Compliance: No SVHC; Color: Black; Number of Rows: 1; Lifecycle Status: Active; Contact Material: Phosphor Bronze; Orientation: Vertical; Mounting Style: Through Hole; Size-Length: 10.2 mm; Size-Width: 2.49 mm; Packaging: Bulk; Manufacturer Part Number: 22-28-4043; Size-Height: 2.29 mm; Octopart URL: https://octopart.com/22-28-4043-molex-278207; Number of Contacts: 4; Housing Color: Black; Housing Material: Nylon; Flammability Rating: UL 94 V-0; Halogen Free Status: Not Low Halogen; Operating Temperature: 75.0 °C (max)
DTMP-A DTMP-B DTMP-C = CMP-3808910-8: DS18B20+ /Maxim Integrated (Dallas)/ Digital temperature sensor, TO-92, -55/+125C, RoHS; Supply Voltage (DC): 3.00 V (min), 5.50 V (max); Number of Bits: 12; Supply Current: 1.00 mA; Output Current: 4.00 mA; Mounting Style: Through Hole; Octopart URL: https://octopart.com/ds18b20%2B-maxim+integrated-1010921; Manufacturer Part Number: DS18B20+; Packaging: Bulk; Number of Pins: 3
DTMP-RES PUR-SCL2 PUR-SDA1 PUR-SDA2 PUR-SLC1 = CMP-2511ecee5430fad6-2: Res Metal Film 4.7K Ohm 1% 3/5W ±50ppm/°C Conformal AXL Thru-Hole Ammo Pack; Manufacturer Part Number: LR1F4K7; Temperature Coefficient: -50.0 ppm/°C to 50.0 ppm/°C; Power Rating: 600 mW; Resistance: 4.70 kΩ; Operating Temperature: -55.0 °C to 155 °C; REACH SVHC Compliance: No SVHC; Packaging: Ammo Pack; Lifecycle Status: Active
GND P_IN = CMP-9ab5517917744572-4: Conn Terminal Block 2 POS 5.08mm Screw ST Cable Mount 16A; Lead-Free Status: Lead Free; Octopart URL: https://octopart.com/em250502v-cooper+bussmann-46573735; Manufacturer Part Number: EM250502V
GND-A GND-B GND-C GND-D GND-E GND-F GND-G GND-H GND-I GND-J GND-MAIN HP-A HP-B HP-C HP-D HP-E HP-F HP-G HP-H HP-I HP-J HP-MAIN LP-A LP-B LP-C LP-D LP-E LP-F LP-G LP-H LP-I LP-J LP-MAIN = CMP-0157c85d593dde90-2: Brass Bright Tin Plate .219 inch High for .109 inch Board Width Turret Terminal; Lead-Free Status: Lead Free; Pin Pitch: 2.77 mm; Contact Material: Brass; OctopartID: 0157c85d593dde90; Size-Diameter: 3.17 mm; Manufacturer Part Number: 1502-2; RoHS: Compliant; Material: Brass; Insulation Material: Non-Insulated; Size-Length: 2.77 mm; Octopart URL: http://octopart.com/1502-2-keystone-32012; Contact Plating: Tin
HPO-A HPO-B HPO-C HPO-D HPO-E HPO-F HPO-G HPO-H HPO-I HPO-J = CMP-9ab5517917744572-6: Conn Terminal Block 2 POS 5.08mm Screw ST Cable Mount 16A
I2C1 I2C2 = CMP-8aac4253fa23556b-5: THT Vertical Pin Header WR-PHD, Pitch 2.54 mm, Dual Row, 6 pins; Current Rating: 3.00 A; Number of Contacts: 6; Gender: Male; Mounting Style: Through Hole; REACH SVHC Compliance: No SVHC; Color: Black; Contact Plating: Gold; Octopart URL: https://octopart.com/61300621121-w%C3%BCrth+elektronik-32855529; Contact Material: Copper; OctopartID: 8aac4253fa23556b; Manufacturer Part Number: 61300621121; Operating Temperature: -40.0 °C (min)
RPI = CMP-e7ab2d993b99386c-20: Dev Brd, Rpi Model b, Bcm2835 Processor
S-A S-B S-C S-D S-E S-F S-G S-H S-I S-J = CMP-dgd04bf3j3drhl5uyyz7-27: CONN DIN RCPT 64POS PCB GOLD
TMP36-1-TMP36-3 = CMP-2418272-2: Low Voltage Temperature Sensor, 2.7 to 5.5 V Supply, Industrial, 3-pin TO92 (T-3), Tray; Lead-Free Status: Contains Lead; Supply Current: 5e-05 A; Supply Voltage (DC): 5.0 V; Case/Package: TO-92; Lifecycle Status: Active; Mounting Style: Through Hole; Number of Pins: 3; Octopart Url: https://octopart.com/tmp36gt9-analog+devices-594149; OctopartID: ea38233bdfbb35ff; RoHS: Non-Compliant; Manufacturer Part Number: TMP36GT9